# EAGLE schematic Dimmer (EAGLE 6.6.0)
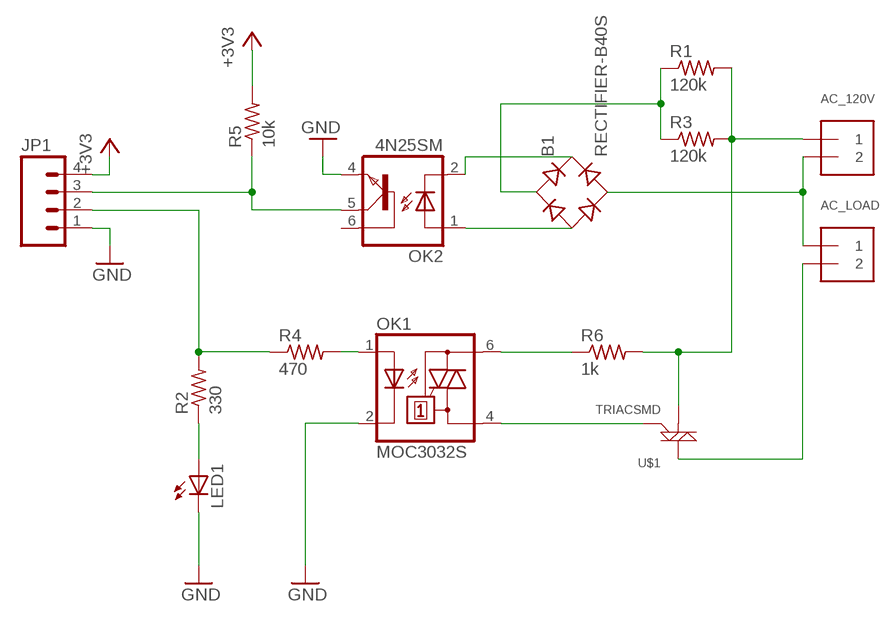
[diagram p0: schematic, sheet 1]

## Parts
AC_120V  TERMBLOCK_1X2  [TERMBLOCK_1X2-3.5MM]
AC_LOAD  TERMBLOCK_1X2  [TERMBLOCK_1X2-3.5MM]
B1  RECTIFIER-B40S  [B40S]
JP1  M04LONGPADS  [1X04_LONGPADS]
LED1  LEDCHIPLED_0603  [CHIPLED_0603]
OK1  MOC3032S  [DIL6-SMD]
OK2  4N25SM  [DIL6-SMD]
R1  120k  R-US_R2512  [R2512]
R2  330  R-US_R0603  [R0603]
R3  120k  R-US_R2512  [R2512]
R4  470  R-US_R0603  [R0603]
R5  10k  R-US_R0603  [R0603]
R6  1k  R-US_R2512  [R2512]
U$1  TRIACSMD  [SOT223]

## Nets
+3V3: JP1.4 R5.2
GND: JP1.1 LED1.C OK1.2(C) OK2.4(EMI)
N$1: JP1.3 OK2.5(COL) R5.1
N$2: B1.AC1 R1.1 R3.1
N$3: B1.- OK2.1(A)
N$4: AC_120V.2 AC_LOAD.1 B1.AC2
N$5: OK1.6(A2) R6.1
N$6: LED1.A R2.1
N$7: OK1.1(A) R4.2
N$8: JP1.2 R2.2 R4.1
N$9: OK1.4(A1) U$1.3(G)
N$10: AC_LOAD.2 U$1.2(M2)
N$11: AC_120V.1 R1.2 R3.2 R6.2 U$1.1(M1)
N$12: B1.+ OK2.2(C)
Unconnected: OK2.6(BAS)

## Library data of the parts
AC_120V AC_LOAD = microbuilder:TERMBLOCK_1X2: 3.5mm Terminal block http://www.ladyada.net/library/pcb/eaglelibrary.html
B1 = rectifier:RECTIFIER-: Rectifier
JP1 = SparkFun-Connectors:M04: Header 4 Standard 4-pin 0.1" header. Use with straight break away headers (SKU : PRT-00116), right angle break away headers (PRT-00553), swiss pins (PRT-00743), machine pins (PRT-00117), and female headers (PRT-00115). Molex polarized connector foot print use with SKU : PRT-08231 with associated crimp pins and housings. 1MM SMD Version SKU: PRT-10208
LED1 = adafruit:LED: LED OSRAM: - CHIPLED LG R971, LG N971, LY N971, LG Q971, LY Q971, LO R971, LY R971 LH N974, LH R974 LS Q976, LO Q976, LY Q976 LO Q996 - Hyper CHIPLED LW Q18S LB Q993, LB Q99A, LB R99A - SideLED LS A670, LO A670, LY A670, LG A670, LP A670 LB A673, LV A673, LT A673, LW A673 LH A674 LY A675 LS A676, LA A676, LO A676, LY A676, LW A676 LS A679, LY A679, LG A679 - Hyper Micro SIDELED® LS Y876, LA Y876, LO Y876, LY Y876 LT Y87S - SmartLED LW L88C, LW L88S LB L89C, LB L89S, LG L890 LS L89K, LO L89K, LY L89K LS L896, LA L896, LO L896, LY L896 - TOPLED LS T670, LO T670, LY T670, LG T670, LP T670 LSG T670, LSP T670, LSY T670, LOP T670, LYG T670 LG T671, LOG T671, LSG T671 LB T673, LV T673, LT T673, LW T673 LH T674 LS T676, LA T676, LO T676, LY T676, LB T676, LH T676, LSB T676, LW T676 LB T67C, LV T67C, LT T67C, LS T67K, LO T67K, LY T67K, LW E67C LS E67B, LA E67B, LO E67B, LY E67B, LB E67C, LV E67C, LT E67C LW T67C LS T679, LY T679, LG T679 LS T770, LO T770, LY T770, LG T770, LP T770 LB T773, LV T773, LT T773, LW T773 LH T774 LS E675, LA E675, LY E675, LS T675 LS T776, LA T776, LO T776, LY T776, LB T776 LHGB T686 LT T68C, LB T68C - Hyper Mini TOPLED® LB M676 - Mini TOPLED Santana® LG M470 LS M47K, LO M47K, LY M47K Source: http://www.osram.convergy.de/
OK1 = optocoupler:MOC30*: 6-Pin DIP Zero-Cross Optoisolators Triac Driver Output (250/400 Volt Peak) Source: Data sheet <http://www.fairchildsemi.com/ds/MO/MOC3031M.pdf> The old path of data sheet not more available 2013-05-06.; MF: FAIRCHILD SEMICONDUCTOR; MPN: MOC3032S-M; OC_FARNELL: unknown; OC_NEWARK: 05C2871
OK2 = optocoupler:4N*?M: General Purpose 6-Pin Phototransistor Optocouplers Source: http://www.fairchildsemi.com/ds/4N/4N35-M.pdf; MF: FAIRCHILD SEMICONDUCTOR; MPN: 4N25SM; OC_FARNELL: 1021152; OC_NEWARK: 34C2020
R1-R6 = resistor:R-US_: RESISTOR, American symbol
U$1 = SparkFun-DiscreteSemi:TRIAC: Low-power generic TRIAC packages